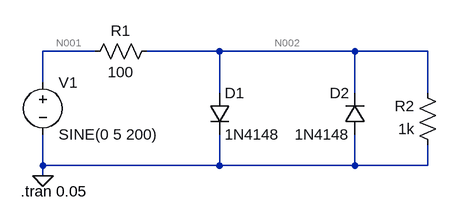
[diagram p0: schematic 1_3a.asc]
1_3a.asc, the LTspice schematic file:
Version 4
SHEET 1 880 680
WIRE 16 80 -64 80
WIRE 208 80 96 80
WIRE 416 80 208 80
WIRE 528 80 416 80
WIRE -64 128 -64 80
WIRE 208 144 208 80
WIRE 416 144 416 80
WIRE 528 144 528 80
WIRE -64 256 -64 208
WIRE 208 256 208 208
WIRE 208 256 -64 256
WIRE 416 256 416 208
WIRE 416 256 208 256
WIRE 528 256 528 224
WIRE 528 256 416 256
WIRE -64 272 -64 256
FLAG -64 272 0
SYMBOL voltage -64 112 R0
WINDOW 123 0 0 Left 0
WINDOW 39 0 0 Left 0
SYMATTR InstName V1
SYMATTR Value SINE(0 5 200)
SYMBOL res 112 64 R90
WINDOW 0 0 56 VBottom 2
WINDOW 3 32 56 VTop 2
SYMATTR InstName R1
SYMATTR Value 100
SYMBOL res 544 240 R180
WINDOW 0 36 76 Left 2
WINDOW 3 36 40 Left 2
SYMATTR InstName R2
SYMATTR Value 1k
SYMBOL diode 192 144 R0
SYMATTR InstName D1
SYMATTR Value 1N4148
SYMBOL diode 432 208 R180
WINDOW 0 24 64 Left 2
WINDOW 3 24 0 Left 2
SYMATTR InstName D2
SYMATTR Value 1N4148
TEXT -98 296 Left 2 !.tran 0.05

The netlist it stands for:
* 1_3a.asc
V1 N001 0 SINE(0 5 200)
R1 N002 N001 100
R2 0 N002 1k
D1 N002 0 1N4148
D2 0 N002 1N4148
.model D D
.lib standard.dio
.tran 0.05
.backanno
.end

* Results of the author's LTspice run, read from the files saved beside the schematic
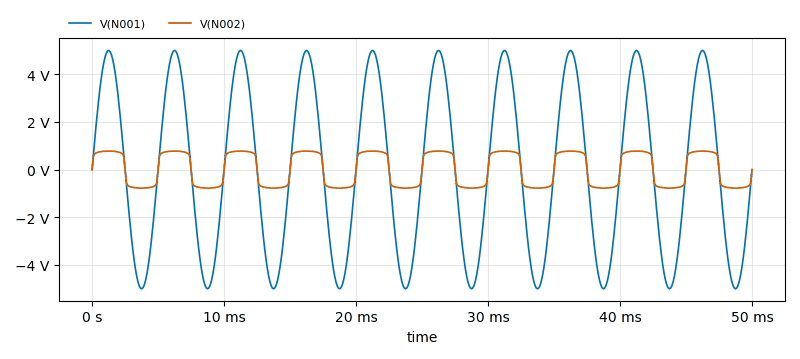
[diagram p1: Transient Analysis of 1_3a.asc, plotted from the saved traces]
* Transient Analysis, 1 run:
*   V(N001): min -5 V, max 5 V, average 3.433 µV, rms 3.534 V, last 0 V
*   V(N002): min -776.4 mV, max 776.4 mV, average 2.611 µV, rms 712.5 mV, last -423.5 nV